# Altium schematic sheet LED.SchDoc
size A; SheetNumber: 9; SheetTotal: 9
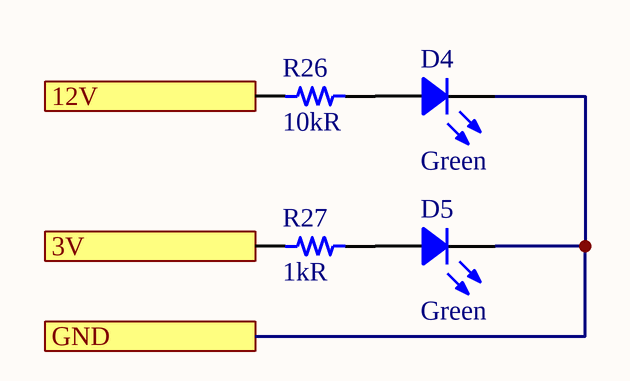
[diagram p0: LED.SchDoc]

## Parts
D4  Green  [LED 0603_1608 GREEN]
D5  Green  [LED 0603_1608 GREEN]
R26  10kR  [RES 0402_1005]
R27  1kR  [RES 0402_1005]

## Ports
3V, 12V, GND

## Nets
3V: R27.2 ; port 3V
12V: R26.2 ; port 12V
GND: D4.2 D5.2 ; port GND
NetD4_1: D4.1 R26.1
NetD5_1: D5.1 R27.1

## Library data of the parts
D4 D5 = SECU1413C-TG20: GREEN, D=564NM, IV=75MCD; Manufacturer: Sanken; Current - Test: 20mA; Lens Size: 0.92mm Dia; Lens Style: Round with Domed Top; Millicandela Rating: 75mcd; Viewing Angle: 60°; Voltage - Forward (Vf) (Typ): 2.1V; Wavelength - Dominant: 564nm; Part Number: SECU1413C-TG20; Color: Green; ComponentLink1Description: Datasheet; ComponentLink1URL: https://www.semicon.sanken-ele.co.jp/sk_content/secu1413c-tg20_ds_en.pdf; ComponentLink2Description: DigiKey Link; ComponentLink2URL: https://www.digikey.com/en/products/detail/sanken/SECU1413C-TG20/16639358; Device Package: 0603 (1608 Metric); Height (Max): 1.48mm; LastUpdated: 6/3/2024 7:58:48 PM; Lifecycle Status: Active; Minimum Order: 1; Mounting Type: Surface Mount; Package / Case: 0603 (1608 Metric); Packaging: CutTape; PartId: 1166; Part Status: Active; Price: 0.28; Series: -; Size / Dimension: 1.60mm L x 0.80mm W; Supplier 1: DigiKey; Supplier Part Number 1: 1261-SECU1413C-TG20TR-ND; Supplier Device Package: 0603; Value: Green
R26 R27 = RP73PF1E249KBTD: RES 249K OHM 0.1% 1/10W 0402; Manufacturer: TE Connectivity Passive Product; Value: 249 kOhms; Power (Watts): 0.1W, 1/10W; Temperature Coefficient: ±25ppm/°C; Part Number: RP73PF1E249KBTD; ComponentLink1Description: Datasheet; ComponentLink1URL: https://www.te.com/commerce/DocumentDelivery/DDEController?Action=srchrtrv&DocNm=1773272&DocType=DS&DocLang=English; ComponentLink2Description: DigiKey Link; ComponentLink2URL: https://www.digikey.com/en/products/detail/te-connectivity-passive-product/RP73PF1E249KBTD/8261091; Composition: Thin Film; Device Package: 0402 (1005 Metric); Height - Seated (Max): 0.014" (0.35mm); LastUpdated: 2/9/2024 8:30:24 PM; Lifecycle Status: Active; Minimum Order: 1; Number of Terminations: 2; Operating Temperature: -55°C ~ 155°C; Package / Case: 0402 (1005 Metric); Packaging: TapeAndReel; PartId: 2418; Part Status: Active; Price: 0.07; Resistance: 249 kOhms; Series: RP73, Holsworthy; Size / Dimension: 0.039" L x 0.020" W (1.00mm x 0.50mm); Supplier 1: DigiKey; Supplier Part Number 1: A127549CT-ND; Supplier Device Package: 0402; Tolerance: ±0.1%